# EAGLE design TCM8230MD (EAGLE 5.11)
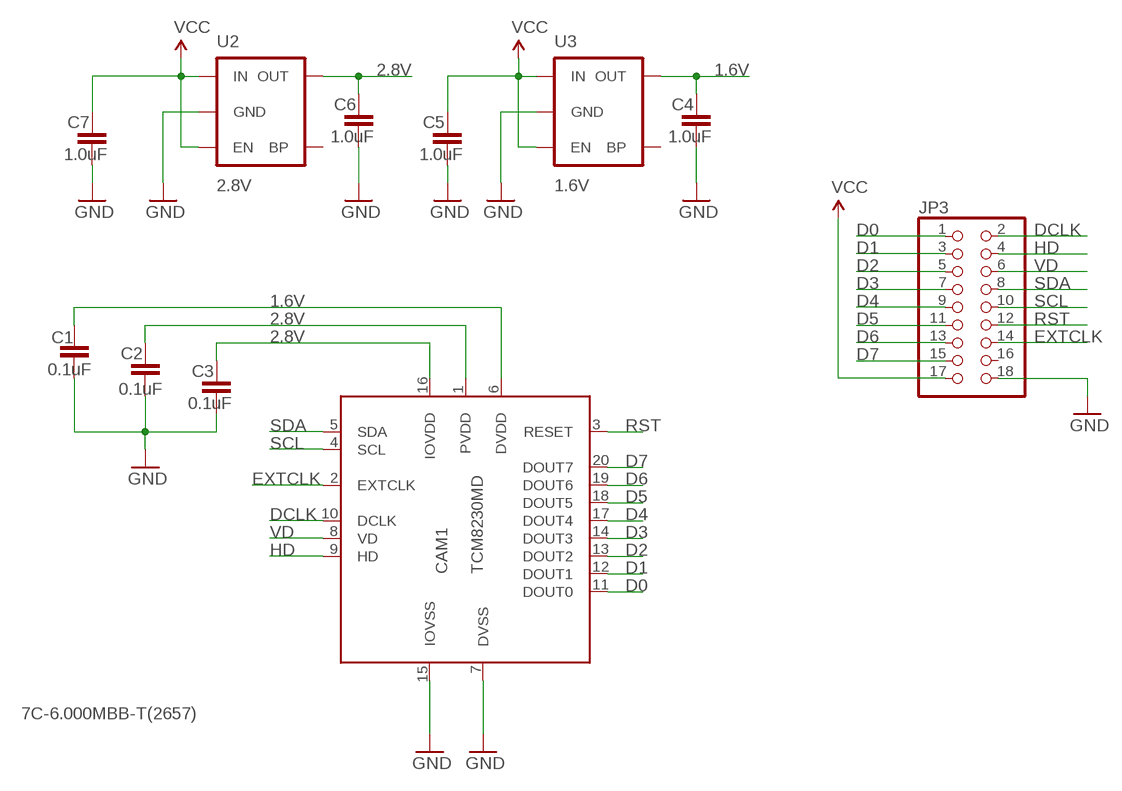
[diagram p0: schematic, sheet 1]

## Parts
C1  0.1uF  CAP0402-CAP  [0402-CAP]
C2  0.1uF  CAP0402-CAP  [0402-CAP]
C3  0.1uF  CAP0402-CAP  [0402-CAP]
C4  1.0uF  CAP0402-CAP  [0402-CAP]
C5  1.0uF  CAP0402-CAP  [0402-CAP]
C6  1.0uF  CAP0402-CAP  [0402-CAP]
C7  1.0uF  CAP0402-CAP  [0402-CAP]
CAM1  TCM8230MD  [TCM8230MD]
JP3  PINHD-2X9  [2X09]
U2  2.8V  V_REG_LDOSMD  [SOT23-5]
U3  1.6V  V_REG_LDOSMD  [SOT23-5]

## Nets
1.6V: C1.1 C4.1 CAM1.6(DVDD) U3.5(OUT)
2.8V: C2.1 C3.1 C6.1 CAM1.1(PVDD) CAM1.16(IOVDD) U2.5(OUT)
D0: CAM1.11(DOUT0) JP3.1
D1: CAM1.12(DOUT1) JP3.3
D2: CAM1.13(DOUT2) JP3.5
D3: CAM1.14(DOUT3) JP3.7
D4: CAM1.17(DOUT4) JP3.9
D5: CAM1.18(DOUT5) JP3.11
D6: CAM1.19(DOUT6) JP3.13
D7: CAM1.20(DOUT7) JP3.15
DCLK: CAM1.10(DCLK) JP3.2
EXTCLK: CAM1.2(EXTCLK) JP3.14
GND: C1.2 C2.2 C3.2 C4.2 C5.2 C6.2 C7.2 CAM1.7(DVSS) CAM1.15(IOVSS) JP3.18 U2.2(GND) U3.2(GND)
HD: CAM1.9(HD) JP3.4
RST: CAM1.3(RESET) JP3.12
SCL: CAM1.4(SCL) JP3.10
SDA: CAM1.5(SDA) JP3.8
VCC: C5.1 C7.1 JP3.17 U2.1(IN) U2.3(EN) U3.1(IN) U3.3(EN)
VD: CAM1.8(VD) JP3.6
Unconnected: JP3.16 U2.4(BP) U3.4(BP)

## Notes on the sheet
- 7C-6.000MBB-T(2657)

## Library data of the parts
C1-C7 = SparkFun:CAP: Capacitor Standard 0603 ceramic capacitor, and 0.1" leaded capacitor.
CAM1 = tcm82x0md:TCM8230MD: TCM8240MD 0.3 Mega pixel sensor chip mfg TOSHIBA symbol/package by Kyrre Aalerud Note: Chip has pads for socket mounting on underside. Do not route anything under the chip unless you insulate it.
JP3 = pinhead:PINHD-2X9: PIN HEADER
U2 U3 = SparkFun:V_REG_LDO: Voltage Regulator LDO Standard 150mA LDO voltage regulator in SOT-23 layout. Micrel part MIC5205. BP (by-pass) pin is used to lower output noise with 470pF cap.

## Board
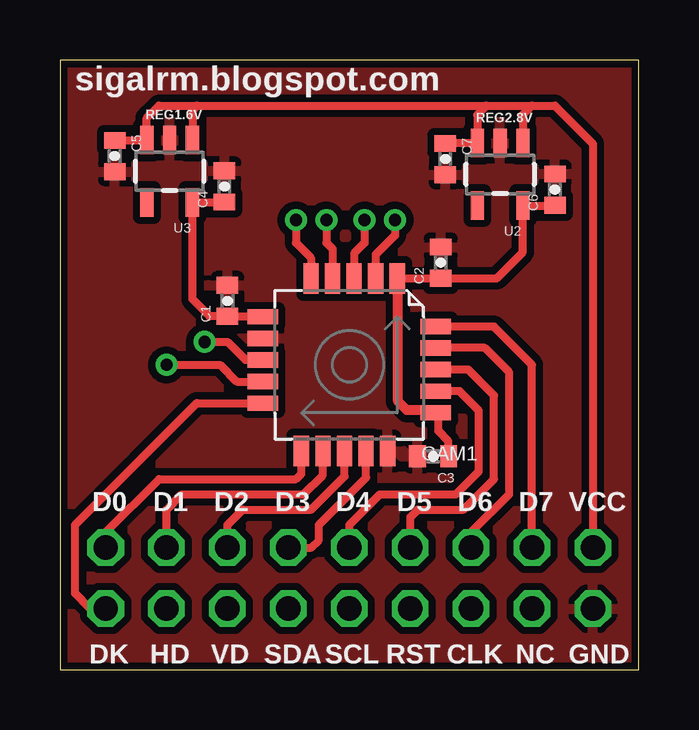
[diagram p1: board, top side]
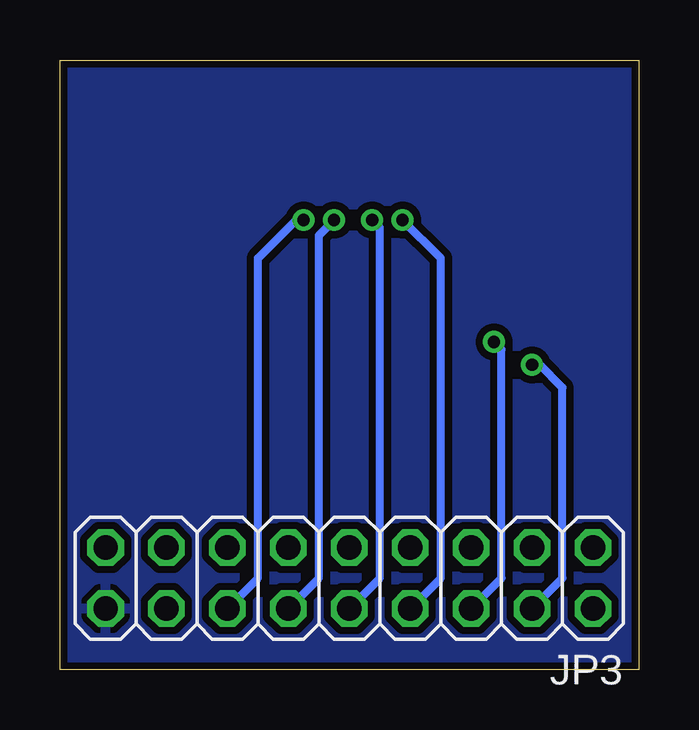
[diagram p2: board, bottom side, seen from below]

Size 24.13 x 25.4 mm. Coordinates in mm from the lower left corner, seen from the top.
Outline: 0,0 24.13,0 24.13,25.4 0,25.4 0,0
Copper layers (1*16): Top 0.035mm / dielectric 1.5mm / Bottom 0.035mm
Design rules "default *": minimum track width 8mil, minimum drill 20mil, track to track 8mil, track to pad 8mil, pad to pad 8mil, via to via 8mil, smd to smd 8mil, copper to edge 12mil, drill to drill 8mil, minimum pad ring 10mil, minimum via ring 8mil, stop-mask expansion 4mil, vias tented up to drill 20mil, thermal gap 10mil

### Footprints (pad centres in the part's own frame; a part is rotated, then mirrored left to right if it is on the bottom)
0402-CAP = smd 0.7 x 0.9: 1 -0.65,0; 2 0.65,0
TCM8230MD = smd 0.635 x 1.27: 1 2,3.6; 2 1.1,3.6; 3 0.2,3.6; 4 -0.7,3.6; 5 -1.6,3.6; 11 -2,-3.6; 12 -1.1,-3.6; 13 -0.2,-3.6; 14 0.7,-3.6; 15 1.6,-3.6 | smd 1.27 x 0.635: 6 -3.6,2; 7 -3.6,1.1; 8 -3.6,0.2; 9 -3.6,-0.7; 10 -3.6,-1.6; 16 3.6,-2; 17 3.6,-1.1; 18 3.6,-0.2; 19 3.6,0.7; 20 3.6,1.6
2X09 = drill 1.016 octagon: 1 -10.16,-1.27; 2 -10.16,1.27; 3 -7.62,-1.27; 4 -7.62,1.27; 5 -5.08,-1.27; 6 -5.08,1.27; 7 -2.54,-1.27; 8 -2.54,1.27; 9 0,-1.27; 10 0,1.27; 11 2.54,-1.27; 12 2.54,1.27; 13 5.08,-1.27; 14 5.08,1.27; 15 7.62,-1.27; 16 7.62,1.27; 17 10.16,-1.27; 18 10.16,1.27
SOT23-5 = smd 0.55 x 1.2: 1 -0.95,-1.3; 2 0,-1.3; 3 0.95,-1.3; 4 0.95,1.3; 5 -0.95,1.3

### Placement (x,y rotation side)
C1  6.99,15.37 90 top
C2  15.88,16.95 90 top
C3  15.56,8.89 180 top
C4  6.86,20.13 90 top
C5  2.29,21.4 270 top
C6  20.64,20 90 top
C7  16.07,21.27 270 top
CAM1  12.06,12.7 0 top
JP3  12.06,3.81 180 bottom
U2  18.35,20.64 180 top
U3  4.57,20.77 180 top

### Tracks (layer width: path | path; a pad name or v marks a point on that pad's centre or on a via)
1.6V
  Top 0.33: CAM1.6 8.45,14.72 C1.1 6.24,14.72 5.52,15.43 U3.5 5.54,19.48 C4.1
2.8V
  Top 0.33: 15.78,10.81 15.78,9.94 16.19,9.53 16.19,8.91 C3.1 | CAM1.1 C2.1 18.21,16.31 19.3,17.4 U2.5 20.62,19.34 C6.1
  Top 0.406: CAM1.16 15.78,10.81 14.46,10.81 14.1,11.18 14.1,16.27 CAM1.1
D0
  Top 0.33: CAM1.11 10.06,8.16 9.84,7.94 4.13,7.94 1.91,5.72 JP3.1
D1
  Top 0.33: CAM1.12 10.96,8.11 10.16,7.3 5.08,7.3 4.45,6.67 JP3.3
D2
  Top 0.33: CAM1.13 11.87,8.06 10.48,6.67 7.62,6.67 6.99,6.03 JP3.5
D3
  Top 0.33: JP3.7 10.48,5.08 10.79,5.4 10.79,6.03 12.77,8 CAM1.14
D4
  Top 0.33: CAM1.17 16.66,11.6 17.46,10.8 17.46,8.26 16.51,7.3 13.34,7.3 12.06,6.03 JP3.9
D5
  Top 0.33: CAM1.18 17.03,12.5 18.1,11.43 18.1,7.94 16.83,6.67 14.92,6.67 14.61,6.35 JP3.11
D6
  Top 0.33: CAM1.19 17.71,13.4 18.73,12.38 18.73,7.3 17.14,5.72 JP3.13
D7
  Top 0.33: JP3.15 19.68,12.7 18.1,14.29 15.68,14.29 CAM1.20
DCLK
  Top 0.33: CAM1.10 5.7,11.1 0.64,6.03 0.64,3.18 1.27,2.54 JP3.2
EXTCLK  (via drill 0.51)
  Top 0.33: CAM1.2 13.16,17.29 13.97,18.1 v13.97,18.73
  Bottom 0.33: v13.97,18.73 14.29,18.73 15.88,17.15 15.88,3.81 JP3.14
GND
  pour Top (isolate 0.305): 0,0 0,25.4 24.13,25.4 24.13,0
  pour Bottom (isolate 0.305): 0,0 0,25.4 24.13,25.4 24.13,0
HD  (via drill 0.51)
  Top 0.33: CAM1.9 7.37,12 6.67,12.7 v4.45,12.7
  Bottom 0.33: v4.45,12.7 4.13,12.7 3.17,11.75 3.17,3.81 JP3.4
RST  (via drill 0.51)
  Top 0.33: CAM1.3 12.27,17.35 12.7,17.78 v12.7,18.73
  Bottom 0.33: v12.7,18.73 13.34,18.1 13.34,3.81 JP3.12
SCL  (via drill 0.51)
  Top 0.33: CAM1.4 11.37,17.53 11.11,17.78 v11.11,18.73
  Bottom 0.33: v11.11,18.73 10.79,18.42 10.79,3.81 JP3.10
SDA  (via drill 0.51)
  Top 0.33: CAM1.5 10.46,17.16 9.84,17.78 v9.84,18.73
  Bottom 0.33: v9.84,18.73 8.26,17.15 8.26,3.81 JP3.8
VCC
  Top 0.33: C5.1 3.61,22.05 U3.3 3.62,22.99 4.13,23.5 5.71,23.5 | C7.1 17.39,21.92 U2.3 17.4,23.12 17.78,23.5 | JP3.17 22.23,21.91 20.64,23.5 19.68,23.5 | 5.71,23.5 17.78,23.5 | 17.78,23.5 19.68,23.5 | U3.1 5.52,23.3 5.71,23.5 | U2.1 19.3,23.11 19.68,23.5
VD  (via drill 0.51)
  Top 0.33: CAM1.8 7.74,12.9 6.99,13.65 v6.03,13.65
  Bottom 0.33: v6.03,13.65 5.71,13.34 5.71,3.81 JP3.6

### Text on the board
tPlace: sigalrm.blogspot.com | REG1.6V | REG2.8V | D0 | D1 | D2 | D3 | D4 | D5 | D6 | D7 | VCC | DK | HD | VD | SDA | SCL | RST | CLK | NC | GND